# EAGLE design sofi_v7_main_rev2_1 (EAGLE 9.5.1)
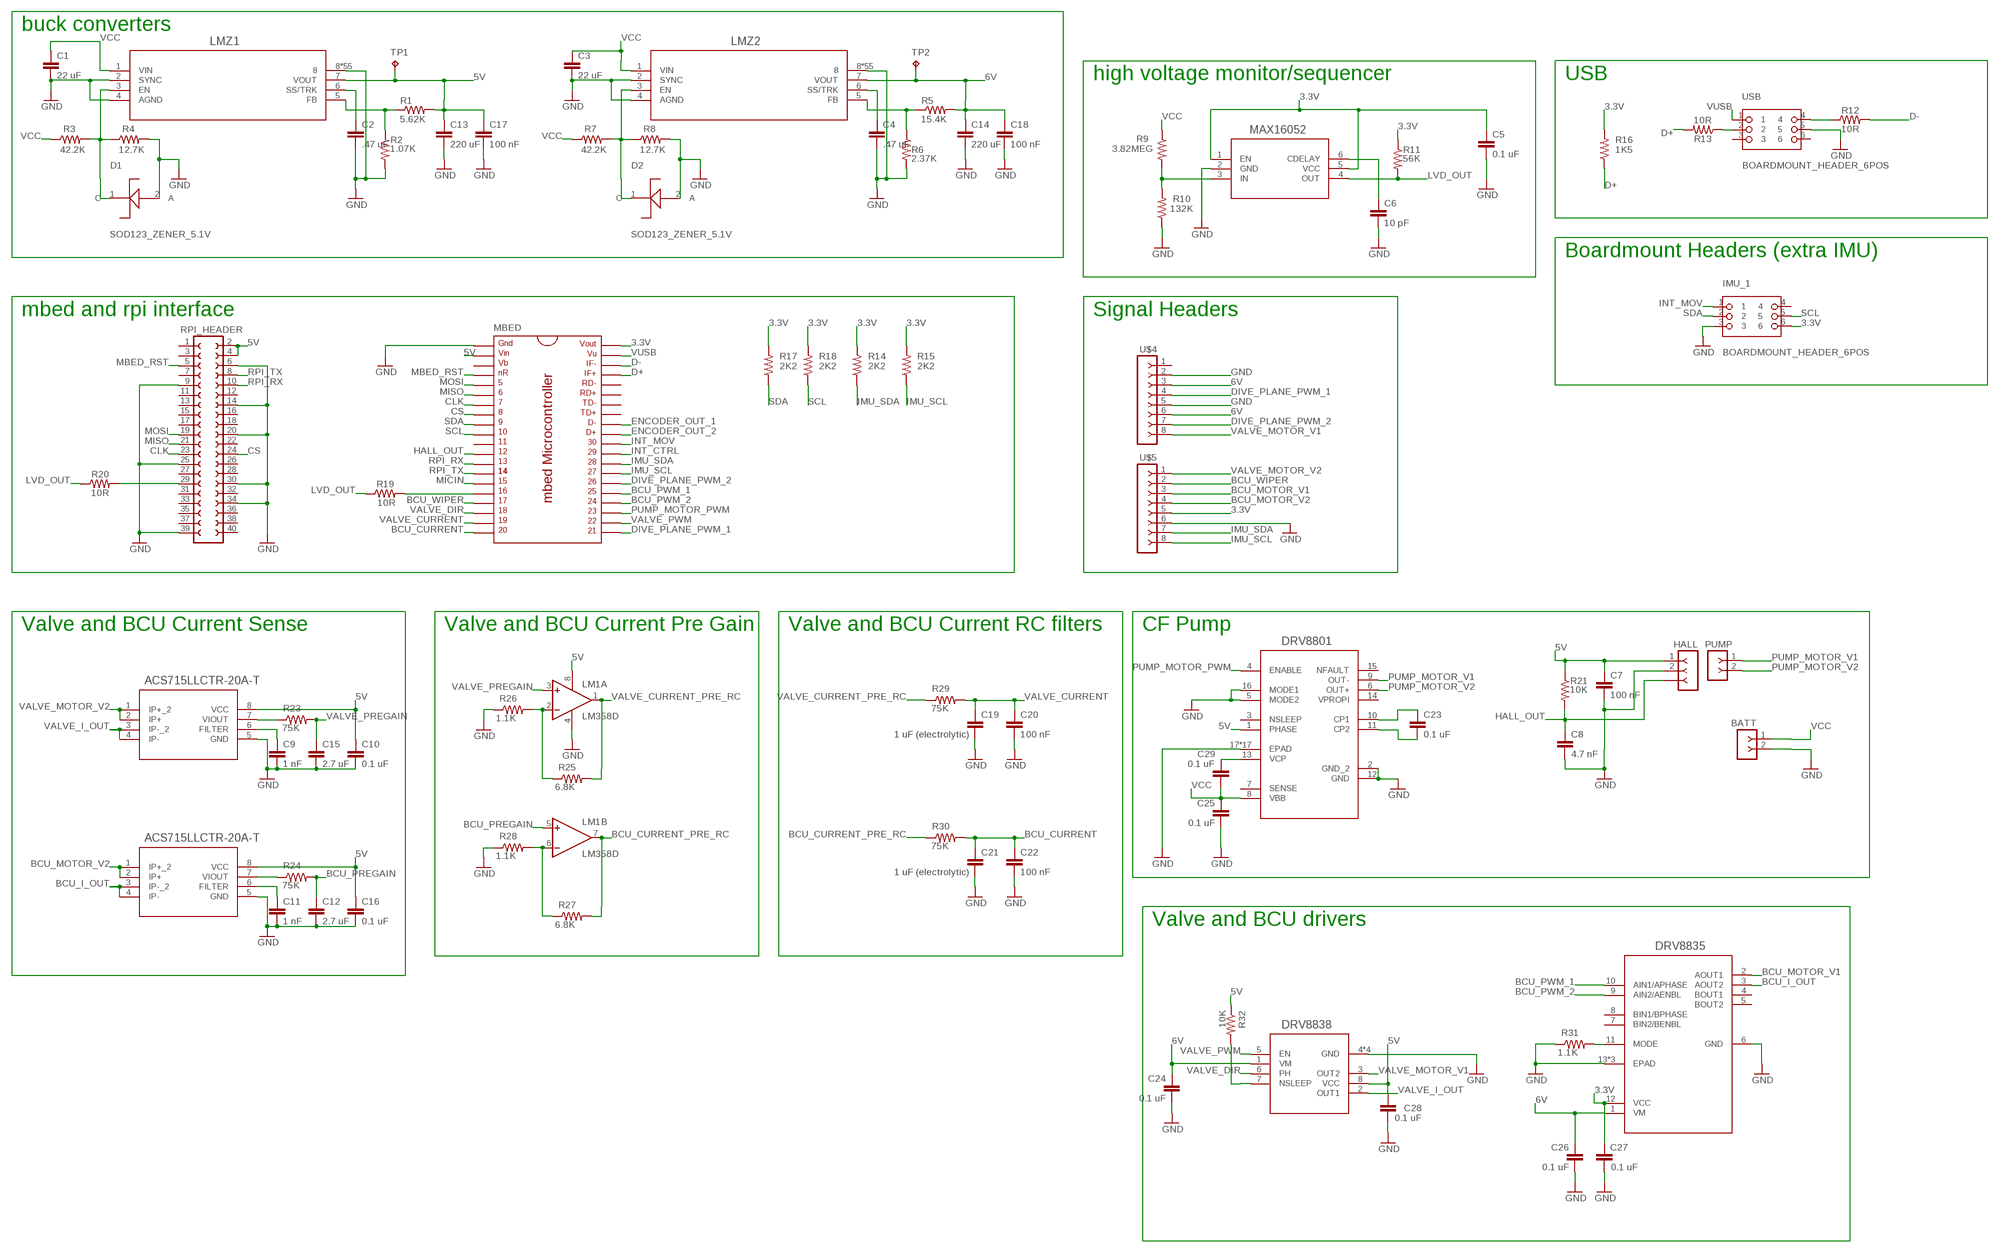
[diagram p0: schematic, sheet 1]

## Parts
BATT  2POS_BLOCK  [2POS_BLOCK]
C1  22 uF  C-EUC0805  [C0805]
C2  .47 uF  C-EUC0805  [C0805]
C3  22 uF  C-EUC0805  [C0805]
C4  .47 uF  C-EUC0805  [C0805]
C5  0.1 uF  C-EUC0805  [C0805]
C6  10 pF  C-EUC0603  [C0603]
C7  100 nF  C-EUC0805  [C0805]
C8  4.7 nF  C-EUC0805  [C0805]
C9  1 nF  C-EUC0603  [C0603]
C10  0.1 uF  C-EUC0603  [C0603]
C11  1 nF  C-EUC0603  [C0603]
C12  2.7 uF  C-EUC0603  [C0603]
C13  220 uF  C-EUC1206  [C1206]
C14  220 uF  C-EUC1206  [C1206]
C15  2.7 uF  C-EUC0603  [C0603]
C16  0.1 uF  C-EUC0603  [C0603]
C17  100 nF  C-EUC0805  [C0805]
C18  100 nF  C-EUC0805  [C0805]
C19  1 uF (electrolytic)  C-EUC0603  [C0603]
C20  100 nF  C-EUC0805  [C0805]
C21  1 uF (electrolytic)  C-EUC0603  [C0603]
C22  100 nF  C-EUC0805  [C0805]
C23  0.1 uF  C-EUC0805  [C0805]
C24  0.1 uF  C-EUC0603  [C0603]
C25  0.1 uF  C-EUC0603  [C0603]
C26  0.1 uF  C-EUC0603  [C0603]
C27  0.1 uF  C-EUC0603  [C0603]
C28  0.1 uF  C-EUC0603  [C0603]
C29  0.1 uF  C-EUC0805  [C0805]
D1  SOD123_ZENER_5.1V  [SOD123_ZENER]
D2  SOD123_ZENER_5.1V  [SOD123_ZENER]
DRV8801  DRV8801RTYTRTY16-THERMAL  [RTY16-THERMAL]
DRV8835  DRV8835DSSRDSS12_P9X2_THERMAL  [DSS12_P9X2_THERMAL]
DRV8838  DRV8838DSGTDSG8_P9X1P6_THERMAL  [DSG8_P9X1P6_THERMAL]
HALL  3POS_TERMINAL  [3POS_TERMINAL]
IMU_1  BOARDMOUNT_HEADER_6POS  [BOARDMOUNT_HEADER]
LM1  LM358D  [SO08]
LMZ1  LMZ23605TZE/NOPBTZA07A_THERMAL_TABBED  [TZA07A_THERMAL_TABBED]
LMZ2  LMZ23605TZE/NOPBTZA07A_THERMAL_TABBED  [TZA07A_THERMAL_TABBED]
MAX16052  MAX16052AUT+T  [21-0058I]
MBED  MBED_MICROCONTROLLER  [DIL40_0.9]
PUMP  2POS_BLOCK  [2POS_BLOCK]
R1  5.62K  R-US_M0805  [M0805]
R2  1.07K  R-US_M0805  [M0805]
R3  42.2K  R-US_M0805  [M0805]
R4  12.7K  R-US_M0805  [M0805]
R5  15.4K  R-US_M0805  [M0805]
R6  2.37K  R-US_M0805  [M0805]
R7  42.2K  R-US_M0805  [M0805]
R8  12.7K  R-US_M0805  [M0805]
R9  3.82MEG  RESISTOR0603  [0603]
R10  132K  RESISTOR0603  [0603]
R11  56K  R-US_R0603  [R0603]
R12  10R  RESISTOR0603  [0603]
R13  10R  RESISTOR0603  [0603]
R14  2K2  RESISTOR0603  [0603]
R15  2K2  RESISTOR0603  [0603]
R16  1K5  RESISTOR0603  [0603]
R17  2K2  RESISTOR0603  [0603]
R18  2K2  RESISTOR0603  [0603]
R19  10R  RESISTOR0603  [0603]
R20  10R  RESISTOR0603  [0603]
R21  10K  R-US_M0805  [M0805]
R23  75K  R-US_M0805  [M0805]
R24  75K  R-US_M0805  [M0805]
R25  6.8K  R-US_M0805  [M0805]
R26  1.1K  R-US_M0805  [M0805]
R27  6.8K  R-US_M0805  [M0805]
R28  1.1K  R-US_M0805  [M0805]
R29  75K  R-US_M0805  [M0805]
R30  75K  R-US_M0805  [M0805]
R31  1.1K  R-US_M0805  [M0805]
R32  10K  R-US_M0805  [M0805]
RPI_HEADER  FE20-2  [FE20-2]
TP1  TPB1,27  [B1,27]
TP2  TPB1,27  [B1,27]
U3_BCU  ACS715LLCTR-20A-T  [SOIC-8]
U3_VALVE  ACS715LLCTR-20A-T  [SOIC-8]
U$4  8POS_TERMINAL  [8POS_TERMINAL]
U$5  8POS_TERMINAL  [8POS_TERMINAL]
USB  BOARDMOUNT_HEADER_6POS  [BOARDMOUNT_HEADER]

## Nets
3.3V: C5.1 C27.1 DRV8835.12(VCC) IMU_1.6 MAX16052.1(EN) MAX16052.5(VCC) MBED.40 R11.1 R14.2 R15.2 R16.2 R17.2 R18.2 U$5.5
5V: C7.1 C10.1 C13.1 C16.1 C17.1 C28.1 DRV8801.1(PHASE) DRV8838.8(VCC) HALL.1 LM1.8(P:V+) LMZ1.7(VOUT) MBED.2 R1.2 R21.1 R32.1 RPI_HEADER.2 RPI_HEADER.4 TP1.TP U3_BCU.8(VCC) U3_VALVE.8(VCC)
6V: C14.1 C18.1 C24.1 C26.1 DRV8835.1(VM) DRV8838.1(VM) LMZ2.7(VOUT) R5.2 TP2.TP U$4.3 U$4.6
BCU_CURRENT: C21.1 C22.1 MBED.20 R30.2
BCU_CURRENT_PRE_RC: LM1.7(B:OUT) R27.2 R30.1
BCU_I_OUT: DRV8835.3(AOUT2) U3_BCU.3(IP-_2) U3_BCU.4(IP-)
BCU_MOTOR_V1: DRV8835.2(AOUT1) U$5.3
BCU_MOTOR_V2: U3_BCU.1(IP+_2) U3_BCU.2(IP+) U$5.4
BCU_PREGAIN: C12.1 LM1.5(B:+IN) R24.2
BCU_PWM_1: DRV8835.10(AIN1/APHASE) MBED.25
BCU_PWM_2: DRV8835.9(AIN2/AENBL) MBED.24
BCU_WIPER: MBED.17 U$5.2
CLK: MBED.7 RPI_HEADER.23
CS: MBED.8 RPI_HEADER.24
D+: MBED.37 R13.2 R16.1
D-: MBED.38 R12.2
DIVE_PLANE_PWM_1: MBED.21 U$4.4
DIVE_PLANE_PWM_2: MBED.26 U$4.7
ENCODER_OUT_1: MBED.32
ENCODER_OUT_2: MBED.31
GND: BATT.2 C1.2 C2.2 C3.2 C4.2 C5.2 C6.2 C7.2 C8.2 C9.2 C10.2 C11.2 C12.2 C13.2 C14.2 C15.2 C16.2 C17.2 C18.2 C19.2 C20.2 C21.2 C22.2 C24.2 C25.2 C26.2 C27.2 C28.2 D1.2(A) D2.2(A) DRV8801.2(GND_2) DRV8801.5(MODE2) DRV8801.12(GND) DRV8801.16(MODE1) DRV8801.17(EPAD) DRV8801.P$1(EPAD) DRV8801.P$2(EPAD) DRV8801.P$3(EPAD) DRV8801.P$4(EPAD) DRV8801.P$5(EPAD) DRV8801.P$6(EPAD) DRV8801.P$7(EPAD) DRV8801.P$8(EPAD) DRV8801.P$9(EPAD) DRV8801.P$10(EPAD) DRV8801.P$11(EPAD) DRV8801.P$12(EPAD) DRV8801.P$13(EPAD) DRV8801.P$14(EPAD) DRV8801.P$15(EPAD) DRV8801.P$16(EPAD) DRV8835.6(GND) DRV8835.13(EPAD) DRV8835.P$1(EPAD) DRV8835.P$2(EPAD) DRV8838.4(GND) DRV8838.9(GND) DRV8838.P$1(GND) DRV8838.P$2(GND) HALL.2 IMU_1.3 LM1.4(P:V-) LMZ1.2(SYNC) LMZ1.4(AGND) LMZ1.8 LMZ1.P$1 LMZ1.P$2 LMZ1.P$3 LMZ1.P$4 LMZ1.P$5 LMZ1.P$6 LMZ1.P$7 LMZ1.P$8 LMZ1.P$9 LMZ1.P$10 LMZ1.P$11 LMZ1.P$12 LMZ1.P$13 LMZ1.P$14 LMZ1.P$15 LMZ1.P$16 LMZ1.P$17 LMZ1.P$18 LMZ1.P$19 LMZ1.P$20 LMZ1.P$21 LMZ1.P$22 LMZ1.P$23 LMZ1.P$24 LMZ1.P$25 LMZ1.P$26 LMZ1.P$27 LMZ1.P$28 LMZ1.P$29 LMZ1.P$30 LMZ1.P$31 LMZ1.P$32 LMZ1.P$33 LMZ1.P$34 LMZ1.P$35 LMZ1.P$36 LMZ1.P$37 LMZ1.P$38 LMZ1.P$39 LMZ1.P$40 LMZ1.P$41 LMZ1.P$42 LMZ1.P$43 LMZ1.P$44 LMZ1.P$45 LMZ1.P$46 LMZ1.P$47 LMZ1.P$48 LMZ1.P$49 LMZ1.P$50 LMZ1.P$51 LMZ1.P$52 LMZ1.P$53 LMZ1.P$54 LMZ2.2(SYNC) LMZ2.4(AGND) LMZ2.8 LMZ2.P$1 LMZ2.P$2 LMZ2.P$3 LMZ2.P$4 LMZ2.P$5 LMZ2.P$6 LMZ2.P$7 LMZ2.P$8 LMZ2.P$9 LMZ2.P$10 LMZ2.P$11 LMZ2.P$12 LMZ2.P$13 LMZ2.P$14 LMZ2.P$15 LMZ2.P$16 LMZ2.P$17 LMZ2.P$18 LMZ2.P$19 LMZ2.P$20 LMZ2.P$21 LMZ2.P$22 LMZ2.P$23 LMZ2.P$24 LMZ2.P$25 LMZ2.P$26 LMZ2.P$27 LMZ2.P$28 LMZ2.P$29 LMZ2.P$30 LMZ2.P$31 LMZ2.P$32 LMZ2.P$33 LMZ2.P$34 LMZ2.P$35 LMZ2.P$36 LMZ2.P$37 LMZ2.P$38 LMZ2.P$39 LMZ2.P$40 LMZ2.P$41 LMZ2.P$42 LMZ2.P$43 LMZ2.P$44 LMZ2.P$45 LMZ2.P$46 LMZ2.P$47 LMZ2.P$48 LMZ2.P$49 LMZ2.P$50 LMZ2.P$51 LMZ2.P$52 LMZ2.P$53 LMZ2.P$54 MAX16052.2(GND) MBED.1 R2.2 R4.2 R6.2 R8.2 R10.1 R26.1 R28.1 R31.1 RPI_HEADER.6 RPI_HEADER.9 RPI_HEADER.14 RPI_HEADER.20 RPI_HEADER.25 RPI_HEADER.30 RPI_HEADER.34 RPI_HEADER.39 U3_BCU.5(GND) U3_VALVE.5(GND) U$4.2 U$4.5 U$5.6 USB.5
HALL_OUT: C8.1 HALL.3 MBED.12 R21.2
IMU_SCL: MBED.27 R15.1 U$5.8
IMU_SDA: MBED.28 R14.1 U$5.7
INT_CTRL: MBED.29
INT_MOV: IMU_1.1 MBED.30
LVD_OUT: MAX16052.4(OUT) R11.2 R19.1 R20.1
MBED_RST: MBED.4 RPI_HEADER.5
MICIN: MBED.15
MISO: MBED.6 RPI_HEADER.21
MOSI: MBED.5 RPI_HEADER.19
N$1: R20.2 RPI_HEADER.29
N$2: C23.1 DRV8801.10(CP1)
N$6: LMZ1.5(FB) R1.1 R2.1
N$7: MAX16052.3(IN) R9.2 R10.2
N$8: D1.1(C) LMZ1.3(EN) R3.2 R4.1
N$9: C4.1 LMZ2.6(SS/TRK)
N$10: LMZ2.5(FB) R5.1 R6.1
N$11: C2.1 LMZ1.6(SS/TRK)
N$12: C6.1 MAX16052.6(CDELAY)
N$13: D2.1(C) LMZ2.3(EN) R7.2 R8.1
N$16: R23.1 U3_VALVE.7(VIOUT)
N$18: C9.1 U3_VALVE.6(FILTER)
N$19: MBED.16 R19.2
N$20: R24.1 U3_BCU.7(VIOUT)
N$21: C11.1 U3_BCU.6(FILTER)
N$22: C23.2 DRV8801.11(CP2)
N$23: C29.1 DRV8801.13(VCP)
N$25: LM1.2(A:-IN) R25.1 R26.2
N$26: R12.1 USB.4
N$27: LM1.6(B:-IN) R27.1 R28.2
N$28: R13.1 USB.2
N$34: DRV8835.11(MODE) R31.2
N$42: DRV8838.7(NSLEEP) R32.2
PUMP_MOTOR_PWM: DRV8801.4(ENABLE) MBED.23
PUMP_MOTOR_V1: DRV8801.9(OUT-) PUMP.1
PUMP_MOTOR_V2: DRV8801.6(OUT+) PUMP.2
RPI_RX: MBED.13 RPI_HEADER.10
RPI_TX: MBED.14 RPI_HEADER.8
SCL: IMU_1.5 MBED.10 R18.1
SDA: IMU_1.2 MBED.9 R17.1
VALVE_CURRENT: C19.1 C20.1 MBED.19 R29.2
VALVE_CURRENT_PRE_RC: LM1.1(A:OUT) R25.2 R29.1
VALVE_DIR: DRV8838.6(PH) MBED.18
VALVE_I_OUT: DRV8838.2(OUT1) U3_VALVE.3(IP-_2) U3_VALVE.4(IP-)
VALVE_MOTOR_V1: DRV8838.3(OUT2) U$4.8
VALVE_MOTOR_V2: U3_VALVE.1(IP+_2) U3_VALVE.2(IP+) U$5.1
VALVE_PREGAIN: C15.1 LM1.3(A:+IN) R23.2
VALVE_PWM: DRV8838.5(EN) MBED.22
VCC: BATT.1 C1.1 C3.1 C25.1 C29.2 DRV8801.8(VBB) LMZ1.1(VIN) LMZ2.1(VIN) R3.1 R7.1 R9.1
VUSB: MBED.39 USB.1
Unconnected: DRV8801.3(NSLEEP) DRV8801.14(VPROPI) DRV8801.15(NFAULT) DRV8835.4(BOUT1) DRV8835.5(BOUT2) DRV8835.7(BIN2/BENBL) DRV8835.8(BIN1/BPHASE) IMU_1.4 MBED.3 MBED.11 MBED.33 MBED.34 MBED.35 MBED.36 RPI_HEADER.1 RPI_HEADER.3 RPI_HEADER.7 RPI_HEADER.11 RPI_HEADER.12 RPI_HEADER.13 RPI_HEADER.15 RPI_HEADER.16 RPI_HEADER.17 RPI_HEADER.18 RPI_HEADER.22 RPI_HEADER.26 RPI_HEADER.27 RPI_HEADER.28 RPI_HEADER.31 RPI_HEADER.32 RPI_HEADER.33 RPI_HEADER.35 RPI_HEADER.36 RPI_HEADER.37 RPI_HEADER.38 RPI_HEADER.40 U$4.1 USB.3 USB.6

## Notes on the sheet
- buck converters
- high voltage monitor/sequencer | USB
- Boardmount Headers (extra IMU)
- mbed and rpi interface | Signal Headers
- Valve and BCU Current Sense | Valve and BCU Current Pre Gain | Valve and BCU Current RC filters | CF Pump
- Valve and BCU drivers

## Power pins joined to a net without a drawn wire
SENSE: DRV8801.7(SENSE)

## Library data of the parts
BATT PUMP = 2pos_block_terminal:2POS_BLOCK
C1-C12 C15-C29 = rcl:C-EU: CAPACITOR, European symbol; SPICEPREFIX: C
C13 C14 = resistor:C-EU: CAPACITOR, European symbol
D1 D2 = SOD123_ZENER_DIODE:SOD123_ZENER_5.1V
DRV8801 = DRV8801_ultra_librarian:DRV8801RTYT
DRV8835 = DRV8835_ultra_librarian:DRV8835DSSR
DRV8838 = DRV8838:DRV8838DSGT
HALL = 3pos_block_terminal:3POS_TERMINAL
IMU_1 USB = 6pos connector:BOARDMOUNT_HEADER_6POS
LM1 = SO08_linear:LM358: OP AMP also LM158; LM258; LM2904 Source: http://cache.national.com/ds/LM/LM158.pdf
LMZ1 LMZ2 = fish_lmz2_ti:LMZ23605TZE/NOPB
MAX16052 = max:MAX16052AUT+T; MANUFACTURER_PART_NUMBER: max16052aut+t; VENDOR: Maxim Integrated Products
MBED = mbed-microcontroller:MBED_MICROCONTROLLER: mbed Microcontroller, DIP40, 0.9"
R1-R8 R11 R21 R23-R32 = rcl:R-US_: RESISTOR, American symbol; SPICEPREFIX: R
R9 R10 R12-R20 = SparkFun-Resistors:RESISTOR: Generic Resistor Package
RPI_HEADER = con-lsta:FE20-2: FEMALE HEADER; OC_FARNELL: unknown; OC_NEWARK: unknown
TP1 TP2 = testpad:TP: Test pad
U3_BCU U3_VALVE = acs715:ACS715LLCTR-20A-T; MANUFACTURER_PART_NUMBER: ACS715LLCTR20AT; VENDOR: Allegro Microsystems Inc.
U$4 U$5 = 8pos_block_terminal:8POS_TERMINAL

## Board
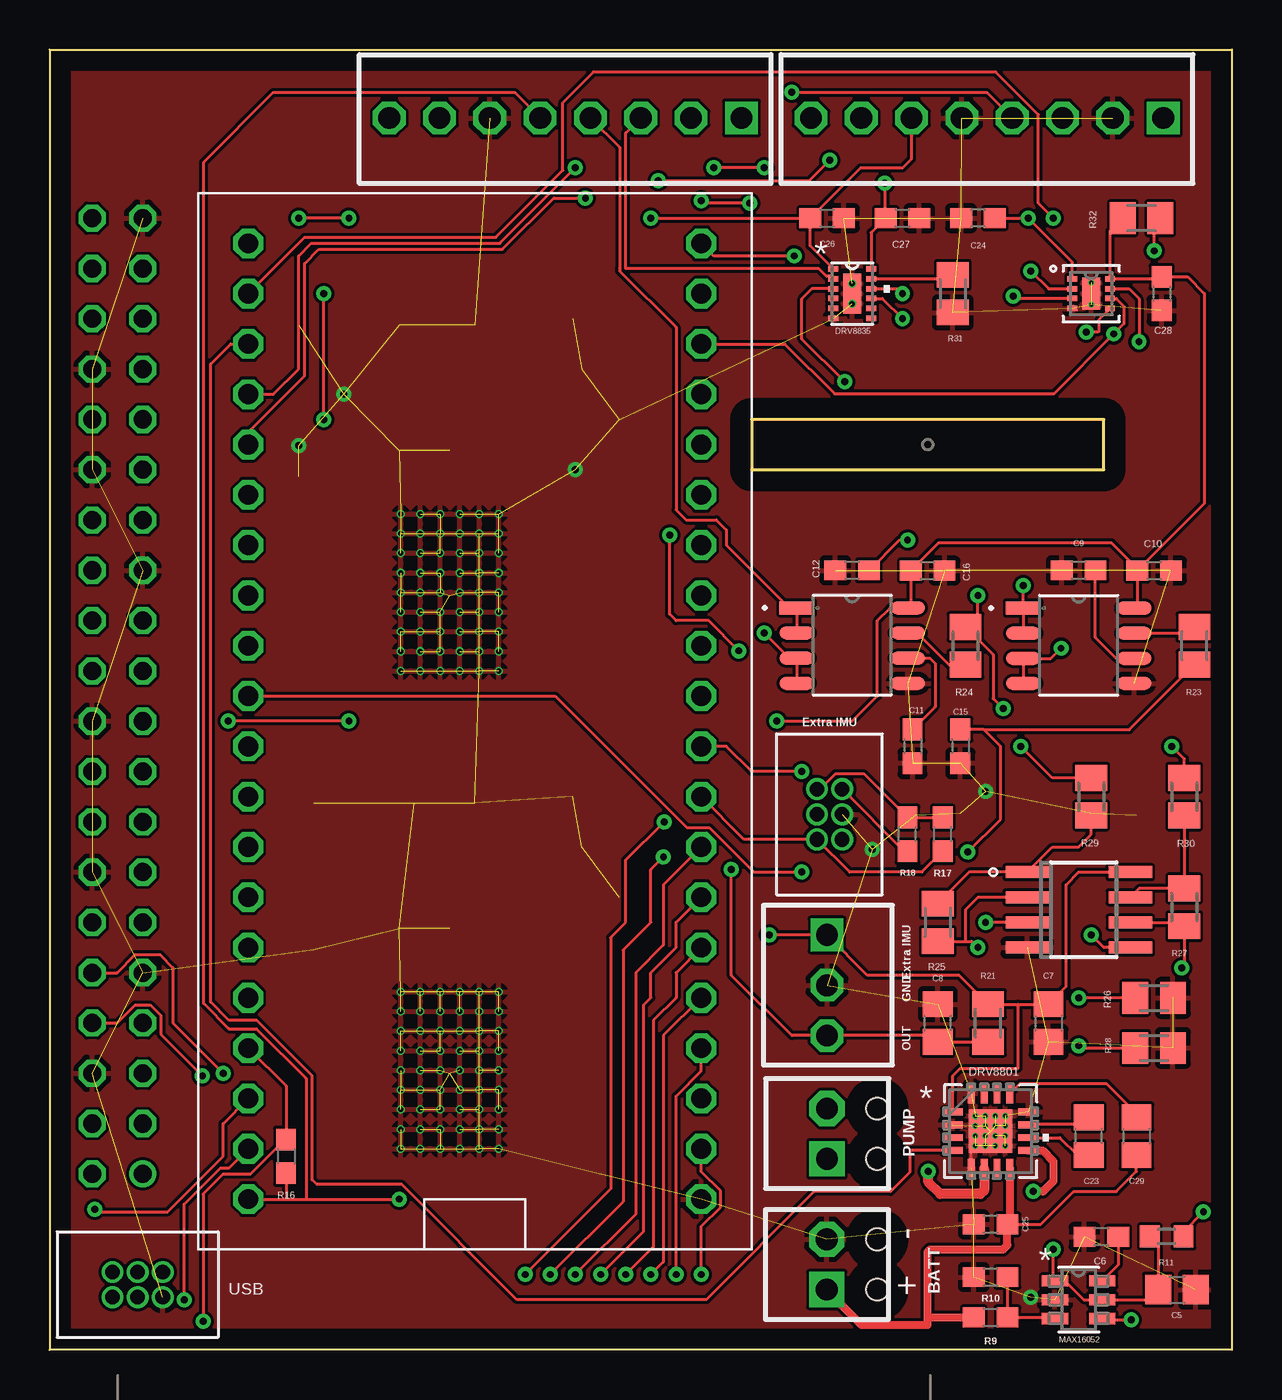
[diagram p1: board, top side]
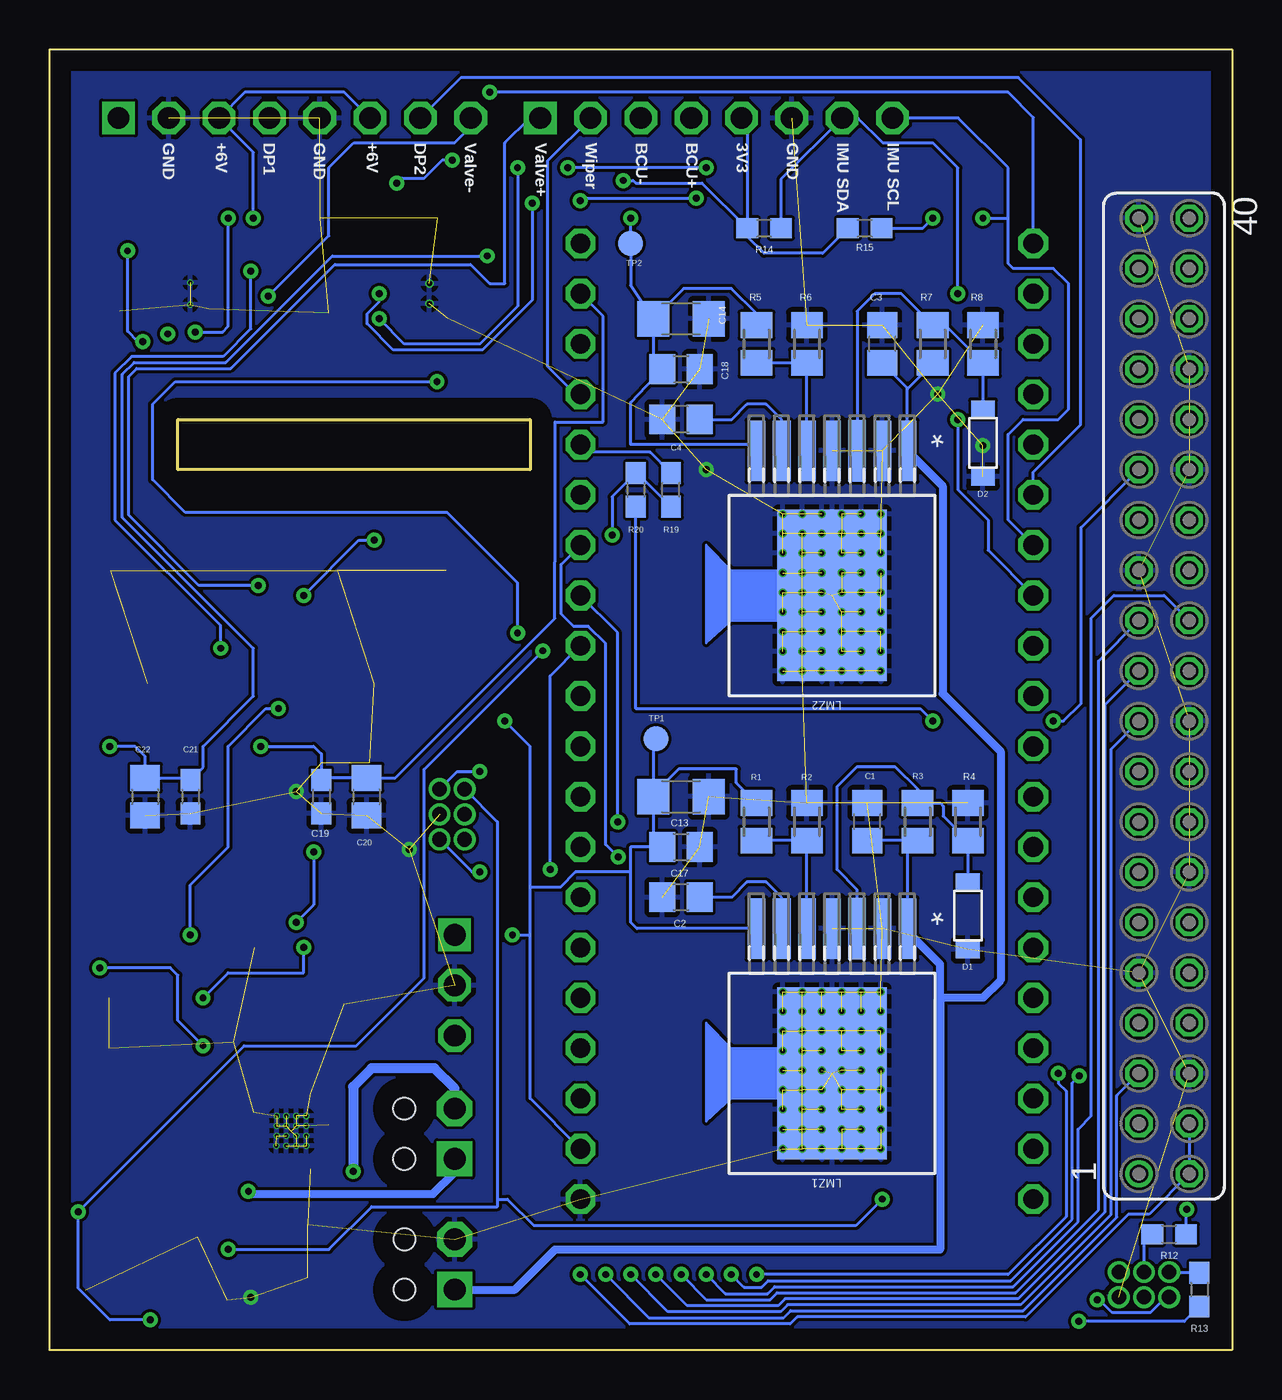
[diagram p2: board, bottom side, seen from below]

Size 59.69 x 65.67 mm. Coordinates in mm from the lower left corner, seen from the top.
Outline: 0,65.67 59.69,65.67 59.69,0 0,0 0,65.67
Outline: 35.43,46.99 35.43,44.45 53.21,44.45 53.21,46.99 35.43,46.99
Copper layers (1*16): Top 0.035mm / dielectric 1.5mm / Bottom 0.035mm
Design rules "default *": minimum track width 6mil, minimum drill 0.35mm, track to track 6mil, track to pad 6mil, pad to pad 5mil, via to via 6mil, smd to smd 6mil, copper to edge 40mil, drill to drill 6mil, minimum pad ring 2mil, minimum via ring 8mil, stop-mask expansion 4mil, vias tented up to drill 0mil, thermal gap 10mil

### Footprints (pad centres in the part's own frame; a part is rotated, then mirrored left to right if it is on the bottom)
2POS_BLOCK = drill 1.1 pad 1.778 square: 1 -1.27,1.27 | drill 1.1 pad 1.778 octagon: 2 1.27,1.27 | hole 1.1: -1.27,-1.27; 1.27,-1.27
C0805 = smd 1.3 x 1.5: 1 -0.95,0; 2 0.95,0
C0603 = smd 1.1 x 1: 1 -0.85,0; 2 0.85,0
C1206 = smd 1.6 x 1.8: 1 -1.4,0; 2 1.4,0
SOD123_ZENER = smd 0.9 x 1.2: 1 0,0; 2 3.4,0
RTY16-THERMAL = smd 1 x 0.35: 1 -1.9,0.975; 2 -1.9,0.325; 3 -1.9,-0.325; 4 -1.9,-0.975; 9 1.9,-0.975; 10 1.9,-0.325; 11 1.9,0.325; 12 1.9,0.975 | smd 0.35 x 1: 5 -0.975,-1.9; 6 -0.325,-1.9; 7 0.325,-1.9; 8 0.975,-1.9; 13 0.975,1.9; 14 0.325,1.9; 15 -0.325,1.9; 16 -0.975,1.9 | smd 2.2 x 2.2: 17 0,0 | drill 0.203 pad 0.254: P$1 -0.762,0.762; P$2 -0.27,0.762; P$3 0.238,0.762; P$4 0.73,0.762; P$5 -0.762,0.27; P$6 -0.27,0.27; P$7 0.238,0.27; P$8 0.73,0.27; P$9 -0.762,-0.238; P$10 -0.27,-0.238; P$11 0.238,-0.238; P$12 0.73,-0.238; P$13 -0.778,-0.746; P$14 -0.27,-0.746; P$15 0.238,-0.746; P$16 0.746,-0.746
DSS12_P9X2_THERMAL = smd 0.5 x 0.28: 1 -0.959,1.25; 2 -0.959,0.75; 3 -0.959,0.25; 4 -0.959,-0.25; 5 -0.959,-0.75; 6 -0.959,-1.25; 7 0.959,-1.25; 8 0.959,-0.75; 9 0.959,-0.25; 10 0.959,0.25; 11 0.959,0.75; 12 0.959,1.25 | smd 0.9 x 2: 13 0,0 | drill 0.279 pad 0.406: P$1 0,0.508; P$2 0,-0.508
DSG8_P9X1P6_THERMAL = smd 0.5 x 0.28: 1 -0.95,0.75; 2 -0.95,0.25; 3 -0.95,-0.25; 4 -0.95,-0.75; 5 0.95,-0.75; 6 0.95,-0.25; 7 0.95,0.25; 8 0.95,0.75 | smd 0.889 x 1.6: 9 0,0 | drill 0.2 pad 0.305: P$1 0,0.55; P$2 0,-0.55
3POS_TERMINAL = drill 1.1 pad 1.3 square: 1 -1.27,0 | drill 1.1 pad 1.3 octagon: 2 1.27,0; 3 3.81,0
BOARDMOUNT_HEADER = drill 0.737: 1 -1.27,-1.27; 2 -1.27,0; 3 0,-1.27; 4 0,0; 5 1.27,-1.27; 6 1.27,0
SO08 = smd 0.6 x 2.2: 1 -1.905,-2.6; 2 -0.635,-2.6; 3 0.635,-2.6; 4 1.905,-2.6; 5 1.905,2.6; 6 0.635,2.6; 7 -0.635,2.6; 8 -1.905,2.6
TZA07A_THERMAL_TABBED = smd 0.89 x 3.06: 1 -3.81,-7.305; 2 -2.54,-7.305; 4 0,-7.305; 5 1.27,-7.305; 6 2.54,-7.305; 7 3.81,-7.305 | smd 0.89 x 3.09: 3 -1.27,-7.305 | smd 5.512 x 8.661: 8 0,0 | drill 0.254 pad 0.406: P$1 -2.464,3.81; P$2 -1.473,3.81; P$3 -0.483,3.81; P$4 0.508,3.81; P$5 1.499,3.81; P$6 2.489,3.81; P$7 -2.464,2.819; P$8 -1.473,2.819; P$9 -0.483,2.819; P$10 0.508,2.819; P$11 1.499,2.819; P$12 2.489,2.819; P$13 -2.464,1.829; P$14 -1.473,1.829; P$15 -0.483,1.829; P$16 0.508,1.829; P$17 1.499,1.829; P$18 2.489,1.829; P$19 -2.464,0.838; P$20 -1.473,0.838; P$21 -0.483,0.838; P$22 0.508,0.838; P$23 1.499,0.838; P$24 2.489,0.838; P$25 -2.464,-0.152; P$26 -1.473,-0.152; P$27 -0.483,-0.152; P$28 0.508,-0.152; P$29 1.499,-0.152; P$30 2.489,-0.152; P$31 -2.464,-1.143; P$32 -1.473,-1.143; P$33 -0.483,-1.143; P$34 0.508,-1.143; P$35 1.499,-1.143; P$36 2.489,-1.143; P$37 -2.464,-2.134; P$38 -1.473,-2.134; P$39 -0.483,-2.134; P$40 0.508,-2.134; P$41 1.499,-2.134; P$42 2.489,-2.134; P$43 -2.464,-3.124; P$44 -1.473,-3.124; P$45 -0.483,-3.124; P$46 0.508,-3.124; P$47 1.499,-3.124; P$48 2.489,-3.124; P$49 -2.464,-4.115; P$50 -1.473,-4.115; P$51 -0.483,-4.115; P$52 0.508,-4.115; P$53 1.499,-4.115; P$54 2.489,-4.115
21-0058I = smd 1.321 x 0.559: 1 -1.194,0.95; 2 -1.194,0; 3 -1.194,-0.95; 4 1.194,-0.95; 5 1.194,0; 6 1.194,0.95
DIL40_0.9 = drill 1 pad 1.397 octagon: 1 -22.86,-11.43; 2 -20.32,-11.43; 3 -17.78,-11.43; 4 -15.24,-11.43; 5 -12.7,-11.43; 6 -10.16,-11.43; 7 -7.62,-11.43; 8 -5.08,-11.43; 9 -2.54,-11.43; 10 0,-11.43; 11 2.54,-11.43; 12 5.08,-11.43; 13 7.62,-11.43; 14 10.16,-11.43; 15 12.7,-11.43; 16 15.24,-11.43; 17 17.78,-11.43; 18 20.32,-11.43; 19 22.86,-11.43; 20 25.4,-11.43; 21 25.4,11.43; 22 22.86,11.43; 23 20.32,11.43; 24 17.78,11.43; 25 15.24,11.43; 26 12.7,11.43; 27 10.16,11.43; 28 7.62,11.43; 29 5.08,11.43; 30 2.54,11.43; 31 0,11.43; 32 -2.54,11.43; 33 -5.08,11.43; 34 -7.62,11.43; 35 -10.16,11.43; 36 -12.7,11.43; 37 -15.24,11.43; 38 -17.78,11.43; 39 -20.32,11.43; 40 -22.86,11.43
M0805 = smd 1.3 x 1.6: 1 -0.95,0; 2 0.95,0
0603 = smd 1.1 x 1: 1 -0.85,0; 2 0.85,0
R0603 = smd 1 x 1.1: 1 -0.85,0; 2 0.85,0
FE20-2 = drill 0.914: 1 -24.13,1.27 | drill 0.914 octagon: 2 -24.13,-1.27; 3 -21.59,1.27; 4 -21.59,-1.27; 5 -19.05,1.27; 6 -19.05,-1.27; 7 -16.51,1.27; 8 -16.51,-1.27; 9 -13.97,1.27; 10 -13.97,-1.27; 11 -11.43,1.27; 12 -11.43,-1.27; 13 -8.89,1.27; 14 -8.89,-1.27; 15 -6.35,1.27; 16 -6.35,-1.27; 17 -3.81,1.27; 18 -3.81,-1.27; 19 -1.27,1.27; 20 -1.27,-1.27; 21 1.27,1.27; 22 1.27,-1.27; 23 3.81,1.27; 24 3.81,-1.27; 25 6.35,1.27; 26 6.35,-1.27; 27 8.89,1.27; 28 8.89,-1.27; 29 11.43,1.27; 30 11.43,-1.27; 31 13.97,1.27; 32 13.97,-1.27; 33 16.51,1.27; 34 16.51,-1.27; 35 19.05,1.27; 36 19.05,-1.27; 37 21.59,1.27; 38 21.59,-1.27; 39 24.13,1.27; 40 24.13,-1.27
B1,27 = smd 1.27 x 1.27: TP 0,0
SOIC-8 = smd 1.753 x 0.66: 1 -2.8,1.905; 2 -2.8,0.635; 3 -2.8,-0.635; 4 -2.8,-1.905; 5 2.8,-1.905; 6 2.8,-0.635; 7 2.8,0.635; 8 2.8,1.905
8POS_TERMINAL = drill 1.1 pad 1.3 square: 1 -8.89,0 | drill 1.1 pad 1.3 octagon: 2 -6.35,0; 3 -3.81,0; 4 -1.27,0; 5 1.27,0; 6 3.81,0; 7 6.35,0; 8 8.89,0

### Placement (x,y rotation side)
BATT  40.5,4.32 90 top
C1  18.42,26.67 90 bottom
C2  27.82,22.86 180 bottom
C3  17.66,50.8 90 bottom
C4  27.82,46.99 180 bottom
C5  56.91,3.05 0 top
C6  53.09,5.72 180 top
C7  50.42,16.51 270 top
C8  44.83,16.51 90 top
C9  51.95,39.37 180 top
C10  55.75,39.36 0 top
C11  43.56,30.48 270 top
C12  40.52,39.37 180 top
C13  27.82,27.94 0 bottom
C14  27.82,52.07 0 bottom
C15  45.98,30.48 270 top
C16  44.32,39.36 0 top
C17  27.82,25.4 0 bottom
C18  27.82,49.53 0 bottom
C19  45.98,27.94 270 bottom
C20  43.69,27.94 270 bottom
C21  52.58,27.94 270 bottom
C22  54.87,27.94 270 bottom
C23  52.45,10.8 90 top
C24  46.86,57.15 180 top
C25  47.5,6.35 180 top
C26  39.24,57.15 0 top
C27  43.05,57.15 0 top
C28  56.14,53.34 270 top
C29  54.87,10.8 270 top
D1  13.34,23.62 270 bottom
D2  12.58,47.5 270 bottom
DRV8801  47.5,11.05 0 top
DRV8835  40.52,53.34 0 top
DRV8838  52.58,53.34 0 top
HALL  39.24,19.69 270 top
IMU_1  38.74,27.05 90 top
LM1  51.95,22.23 270 top
LMZ1  20.2,13.97 180 bottom
LMZ2  20.2,38.1 180 bottom
MAX16052  51.95,2.54 0 top
MBED  21.46,30.48 90 top
PUMP  40.52,10.92 90 top
R1  24.01,26.67 90 bottom
R2  21.46,26.67 90 bottom
R3  15.88,26.67 90 bottom
R4  13.34,26.67 90 bottom
R5  24.01,50.8 90 bottom
R6  21.46,50.8 90 bottom
R7  15.12,50.8 90 bottom
R8  12.58,50.8 90 bottom
R9  47.5,1.65 0 top
R10  47.5,3.68 0 top
R11  56.39,5.74 0 top
R12  3.18,5.84 0 bottom
R13  1.65,3.05 270 bottom
R14  23.62,56.64 180 bottom
R15  18.54,56.64 180 bottom
R16  11.94,9.78 270 top
R17  45.09,26.04 90 top
R18  43.31,26.04 90 top
R19  28.32,43.43 90 bottom
R20  30.1,43.43 270 bottom
R21  47.37,16.51 270 top
R23  57.79,35.56 270 top
R24  46.23,35.56 90 top
R25  44.83,21.59 90 top
R26  55.75,17.78 180 top
R27  57.28,22.35 90 top
R28  55.75,15.25 180 top
R29  52.58,27.94 90 top
R30  57.28,27.94 90 top
R31  45.59,53.34 90 top
R32  55.12,57.15 0 top
RPI_HEADER  3.43,33.02 90 bottom
TP1  29.09,30.86 0 bottom
TP2  30.36,55.88 0 bottom
U3_BCU  40.52,35.57 0 top
U3_VALVE  51.95,35.56 0 top
U$4  47.32,62.21 180 top
U$5  26.03,62.21 180 top
USB  4.45,3.94 0 top

### Tracks (layer width: path | path; a pad name or v marks a point on that pad's centre or on a via)
3.3V  (via drill 0.35)
  Top 0.152: R11.1 55.96,5.32 C5.1 55.45,2.54 MAX16052.5 52.2,2.54 51.25,3.49 MAX16052.1 50.67,3.57 v50.67,5.08 | DRV8835.12 41.47,56.42 C27.1 42.17,57.19 v42.17,58.93 | U$5.5 23.47,63.5 11.3,63.5 7.78,59.97 7.78,17.5 9.06,16.22 10.44,16.22 12.96,13.7 12.96,7.62 | MBED.40 11.94,7.62 | 11.94,7.62 12.96,7.62 | 12.96,7.62 v17.66,7.62 | R17.2 R18.2 41.09,29.1 39.68,29.1 38.9,28.32 IMU_1.6 | v30.74,59.05 38.36,59.05 v39.37,60.07 | R16.2 11.94,7.62
  Bottom 0.152: U$5.5 24.47,61.92 R14.2 | R15.2 20.66,55.37 23.62,55.37 24.47,56.22 R14.2 | v17.66,7.62 19,6.27 35.23,6.27 36.58,7.62 37.09,7.62 | v50.67,5.08 45.59,5.08 43.44,7.24 37.09,7.24 37.09,7.62 | IMU_1.6 37.09,26.67 37.09,7.62 | R14.2 26.76,58.93 30.1,58.93 30.23,59.05 v30.74,59.05 | v42.17,58.93 41.91,59.18 40.77,59.18 39.88,60.07 v39.37,60.07
5V  (via drill 0.35)
  Top 0.152: v32.89,3.81 32.89,6.24 33.87,7.22 33.87,8.02 32.89,9 MBED.2 | 48.9,17.46 R21.1 45.91,18.92 41.28,18.92 HALL.1 v36.32,20.96 | 48.9,17.46 C7.1 51.31,18.35 51.31,23.5 51.95,24.13 LM1.8 | DRV8801.1 45.6,13.85 45.98,14.22 48.9,14.22 48.9,17.46 | C10.1 54.91,37.62 U3_VALVE.8 | R32.1 53.53,56.51 DRV8838.8 56.04,54.09 C28.1 57.45,54.19 58.29,53.34 58.29,42.75 C10.1 | v36.7,31.75 40.52,31.75 41.78,33.02 41.78,36.83 42.43,37.48 U3_BCU.8 43.47,37.63 C16.1 44.88,40.77 53.6,40.77 54.91,39.46 C10.1
  Bottom 0.152: C13.1 29.21,28.06 27.94,29.34 25.02,29.34 25.02,28.64 R1.2 | C17.1 28.83,25.4 | 28.83,25.4 30.36,25.4 30.36,24.13 | C13.1 29.21,25.78 28.83,25.4 | LMZ1.7 30.04,21.28 30.36,21.59 30.36,24.13 | MBED.2 35.43,12.7 35.43,20.96 | 35.43,20.96 35.43,23.37 | 35.43,23.37 35.43,30.48 v36.7,31.75 | TP1.TP 29.21,30.73 C13.1 | v32.89,3.81 30.41,1.32 22.3,1.32 21.95,1.68 10.42,1.68 5.24,6.86 4.19,6.86 RPI_HEADER.2 RPI_HEADER.4 | 30.36,24.13 33.15,24.13 33.91,23.37 35.43,23.37 | v36.32,20.96 35.43,20.96
6V  (via drill 0.35)
  Top 0.152: DRV8835.1 38.39,55.75 C26.1 | v30.36,57.15 C26.1 | C24.1 v49.41,57.15 51.63,54.93 DRV8838.1 | C26.1 40.93,59.69 43.05,59.69 43.51,60.15 U$4.6
  Bottom 0.152: LMZ2.7 24.48,45.72 30.36,45.72 30.36,47.84 C18.1 29.21,49.98 C14.1 | C14.1 30.36,53.76 TP2.TP v30.36,57.15 | C14.1 27.69,53.59 25.28,53.59 24.01,52.32 R5.2 | v49.41,57.15 49.41,60.48 U$4.3 49.84,63.5 44.8,63.5 U$4.6
BCU_CURRENT  (via drill 0.35)
  Top 0.152: R30.2 57.28,29.84 v56.64,30.48 | v37.59,55.24 33.53,55.24 MBED.20
  Bottom 0.152: v56.64,30.48 55.37,30.48 54.87,29.97 C22.1 52.68,28.89 C21.1 51.95,29.43 51.95,30.48 49.41,33.02 49.41,35.43 56.01,42.04 56.01,49.28 55.42,49.86 50.8,49.86 45.42,55.24 v37.59,55.24
BCU_CURRENT_PRE_RC
  Top 0.152: LM1.7 55,23.3 R27.2 R30.1
BCU_I_OUT  (via drill 0.35)
  Top 0.152: U3_BCU.4 U3_BCU.3 37.33,34.94 v36.07,36.2 | DRV8835.3 38.48,53.59 37.97,53.09 37.97,51.05 v40.13,48.9
  Bottom 0.152: v36.07,36.2 36.07,38.73 39.63,42.29 52.83,42.29 54.48,43.94 54.48,47.75 53.34,48.9 v40.13,48.9
BCU_MOTOR_V1
  Top 0.152: DRV8835.2 39.42,54.22 39.21,54.22 38.82,54.61 29.09,54.61 29.09,61.45 U$5.3
BCU_MOTOR_V2
  Top 0.152: U3_BCU.2 U3_BCU.1 37.33,37.48 34.16,40.64 34.16,41.4 33.66,41.91 32.13,41.91 31.63,42.42 31.63,51.64 28.78,54.48 28.78,54.61 28.78,60.73 U$5.4
BCU_PREGAIN  (via drill 0.35)
  Top 0.152: v46.86,38.1 46.86,37.15 R24.2 47.63,35.11 47.63,32.89 v48.13,32.38 | v43.31,40.89 42.89,40.89 C12.1 | LM1.5 53.21,20.32 v52.58,20.96
  Bottom 0.152: v46.86,38.1 44.07,40.89 v43.31,40.89 | v52.58,20.96 52.58,23.5 50.67,25.4 50.67,30.48 48.77,32.38 v48.13,32.38
BCU_PWM_1  (via drill 0.35)
  Top 0.152: DRV8835.10 42.8,53.59 v43.05,53.34 | MBED.25 9.91,45.85 9.91,46.23 12.88,49.2 12.88,54.87 13.59,55.58 22.86,55.58 25.45,58.17 v27.05,58.17 | v32.89,58.04 33.02,57.91 v35.34,57.91
  Bottom 0.152: v27.05,58.17 32.77,58.17 v32.89,58.04 | v35.34,57.91 35.34,53.01 37.85,50.49 42.34,50.49 43.66,51.82 43.66,52.32 43.05,52.93 v43.05,53.34
BCU_PWM_2  (via drill 0.35)
  Top 0.152: DRV8835.9 42.03,53.09 v43.05,52.07 | MBED.24 11.3,48.26 12.58,49.53 12.58,55.24 13.21,55.88 22.74,55.88 v26.55,59.69 | v36.07,59.69 v33.53,59.69
  Bottom 0.152: v43.05,52.07 41.78,50.8 37.97,50.8 36.07,52.7 v36.07,59.69 | v26.55,59.69 v33.53,59.69
BCU_WIPER
  Bottom 0.152: U$5.2 34.55,60.05 34.55,49.66 33.15,48.26 MBED.17
CLK  (via drill 0.35)
  Top 0.152: v27.82,3.81 29.97,5.97 29.97,17.4 30.36,17.78 30.36,19.05 31.63,20.32 31.63,21.59 MBED.7
  Bottom 0.152: RPI_HEADER.23 6.73,34.8 6.73,7.09 10.93,2.9 22.96,2.9 23.32,2.54 26.55,2.54 v27.82,3.81
CS  (via drill 0.35)
  Top 0.152: MBED.8 30.99,23.5 30.99,20.45 29.59,19.05 29.59,6.86 v26.55,3.81
  Bottom 0.152: RPI_HEADER.24 3.43,38.1 5.97,38.1 7.11,36.96 7.11,11.81 7.77,11.15 7.77,6.48 11.05,3.2 23.09,3.2 23.45,2.84 25.58,2.84 v26.55,3.81
D+  (via drill 0.35)
  Top 0.152: v7.75,1.44 7.75,7.87 8.76,8.89 10.15,8.89 11.89,10.63 R16.1 11.94,13.34 MBED.37
  Bottom 0.152: R13.2 2.41,1.44 v7.75,1.44
D-  (via drill 0.35)
  Top 0.152: MBED.38 8.76,11.43 8.76,9.78 5.97,6.99 2.41,6.99 v2.29,7.11
  Bottom 0.152: v2.29,7.11 2.33,7.07 R12.2
DIVE_PLANE_PWM_1  (via drill 0.35)
  Top 0.152: v37.47,63.5 47.3,63.5 U$4.4
  Bottom 0.152: MBED.21 10.04,62.23 11.3,63.5 v37.47,63.5
DIVE_PLANE_PWM_2
  Bottom 0.152: MBED.26 10.04,44.33 7.65,46.71 7.65,61.12 10.79,64.25 38.93,64.25 U$4.7
GND  (via drill 0.35)  (201 unrouted)
  Top 0.152: DRV8801.5 46.52,10.11 DRV8801.P$13 | DRV8801.17 DRV8801.P$11
  other vias: 26.55,44.45 14.86,48.26 12.58,45.67 49.53,2.67 41.53,25.27 47.25,28.19
  pour Top: -0.38,65.28 -0.38,-0.25 59.56,-0.25 59.56,65.28
  pour Bottom: -0.25,65.91 59.56,65.91 59.56,-0.13 -0.25,-0.13
HALL_OUT  (via drill 0.35)
  Top 0.152: R21.2 C8.1 44.52,15.88 HALL.3 37.47,15.88 34.42,18.92 v34.42,24.26
  Bottom 0.152: v34.42,24.26 34.42,34.04 MBED.12
IMU_SCL  (via drill 0.35)
  Top 0.152: v15.12,57.15 v12.58,57.15
  Bottom 0.152: MBED.27 11.3,41.91 11.3,46.23 10.54,46.99 8.76,46.99 8.26,47.5 8.26,53.85 9.02,54.61 11.05,54.61 11.3,54.86 11.3,57.15 | 11.3,57.15 11.3,59.69 13.82,62.21 U$5.8 | R15.1 15.62,56.64 v15.12,57.15 | v12.58,57.15 11.3,57.15
IMU_SDA  (via drill 0.35)
  Top 0.152: v13.85,46.99 v13.85,53.34
  Bottom 0.152: v13.85,46.99 13.85,43.43 12.32,41.91 12.32,40.39 MBED.28 | v13.85,53.34 13.85,59.69 15.09,60.94 17.62,60.94 18.88,62.21 U$5.7 22.77,59.12 R14.1
INT_MOV  (via drill 0.35)
  Top 0.152: MBED.30 25.53,33.02 32.17,26.38 33.3,26.38 35.55,24.13 v37.97,24.13
  Bottom 0.152: IMU_1.1 38.36,24.13 v37.97,24.13
LVD_OUT  (via drill 0.35)
  Top 0.152: v58.25,6.99 57.24,5.98 R11.2 | v31.3,41.15 31.3,37.16 31.63,36.83 33.28,36.83 v34.8,35.31 | MAX16052.4 53.2,1.52 v54.61,1.52
  Bottom 0.152: v54.61,1.52 56.64,1.52 58.25,3.13 v58.25,6.99 49.86,15.37 44.2,15.37 40.79,18.78 40.79,29.32 v34.8,35.31 | R19.1 30.02,44.28 R20.1 31.3,43.09 v31.3,41.15
MBED_RST  (via drill 0.35)
  Top 0.152: MBED.4 32.89,14.08 31.63,12.81 v31.63,3.81
  Bottom 0.152: v31.63,3.81 29.44,1.63 22.63,1.63 22.28,1.98 10.55,1.98 5.82,6.71 5.82,12.85 RPI_HEADER.5
MISO  (via drill 0.35)
  Top 0.152: MBED.6 31.63,19.05 31.63,17.78 30.48,16.64 30.48,5.21 v29.09,3.81
  Bottom 0.152: v29.09,3.81 27.51,2.24 22.91,2.24 22.56,2.59 10.8,2.59 6.43,6.96 6.43,32.56 RPI_HEADER.21
MOSI  (via drill 0.35)
  Top 0.152: MBED.5 30.99,15.88 30.99,4.45 v30.36,3.81
  Bottom 0.152: v30.36,3.81 28.47,1.93 22.79,1.93 22.43,2.29 10.67,2.29 6.12,6.84 6.12,30.33 RPI_HEADER.19
N$1  (via drill 0.35)
  Top 0.152: v15.12,31.75 v9.02,31.75
  Bottom 0.152: v15.12,31.75 15.75,32.38 30.1,32.38 R20.2 | v9.02,31.75 8.51,31.75 7.62,32.64 7.62,41.53 RPI_HEADER.29
N$2
  Top 0.152: DRV8801.10 51,10.72 51.88,9.84 C23.1
N$6
  Bottom 0.152: LMZ1.5 R2.1 R1.1
N$7
  Top 0.152: R10.2 R9.2 50.69,1.65 MAX16052.3
N$8
  Bottom 0.152: D1.1 R4.1 14.58,26.96 14.58,27.48 14.72,27.62 R3.2 15.88,28.32 17.02,29.46 18.93,29.46 19.94,28.45 19.94,24.26 18.93,23.24 LMZ1.3
N$9
  Bottom 0.152: C4.1 25.26,46.99 24.49,47.75 23.52,47.75 22.74,46.97 LMZ2.6
N$10
  Bottom 0.152: R5.1 R6.1 LMZ2.5
N$11
  Bottom 0.152: C2.1 25.26,22.86 24.49,23.62 23.52,23.62 22.74,22.84 LMZ1.6
N$12
  Top 0.152: C6.1 53.94,4.29 MAX16052.6
N$13
  Bottom 0.152: D2.1 R8.1 14.47,51.75 R7.2 16.71,53.34 18.04,53.34 18.93,52.45 LMZ2.3
N$16
  Top 0.152: U3_VALVE.7 57.47,36.2 R23.1
N$18
  Top 0.152: U3_VALVE.6 53.85,34.93 52.79,35.98 C9.1
N$19
  Bottom 0.152: R19.2 29.38,45.34 32.51,45.34 MBED.16
N$20
  Top 0.152: U3_BCU.7 43.81,36.2 45.4,34.61 R24.1
N$21
  Top 0.152: U3_BCU.6 44.44,34.94 44.71,34.67 44.71,32.47 C11.1
N$22
  Top 0.152: DRV8801.11 49.46,11.43 52.14,11.43 C23.2
N$23
  Top 0.152: DRV8801.13 48.99,13.46 53.34,13.46 54.87,11.94 C29.1
N$25  (via drill 0.35)
  Top 0.152: R26.2 v51.95,17.78 | R25.1 46.23,20.64 | 46.23,20.64 46.54,20.64 v46.86,20.32 | 46.23,20.64 46.23,22.23 46.86,22.86 LM1.2
  Bottom 0.152: v51.95,17.78 50.67,19.05 46.86,19.05 v46.86,20.32
N$26
  Bottom 0.152: R12.1 4.45,5.42 USB.4
N$27  (via drill 0.35)
  Top 0.152: v51.95,15.37 52.06,15.25 R28.2 | LM1.6 57.09,21.59 R27.1 57.28,19.43 v57.15,19.3
  Bottom 0.152: v57.15,19.3 53.6,19.3 53.21,18.92 53.21,16.64 v51.95,15.37
N$28
  Bottom 0.152: R13.1 3.14,3.9 USB.2
N$34
  Top 0.152: DRV8835.11 45.39,54.09 R31.2
N$42  (via drill 0.35)
  Top 0.152: v55.75,55.5 55.75,56.84 R32.2 | DRV8838.7 54.49,53.59 54.99,53.09 v54.99,50.93
  Bottom 0.152: v54.99,50.93 55.25,50.93 55.75,51.44 v55.75,55.5
PUMP_MOTOR_PWM
  Top 0.152: DRV8801.4 43.43,10.07 43.43,8.97 42.46,8 38.61,8 33.15,2.54 23.59,2.54 17.78,8.35 13.49,8.35 13.26,8.59 13.26,13.84 10.45,16.65 9.06,16.65 8.13,17.58 8.13,49.78 9.15,50.8 MBED.23
PUMP_MOTOR_V1  (via drill 0.35)
  Top 0.406: DRV8801.9 50.13,10.07 50.67,9.52 50.67,8.53 50.16,8.01 v49.65,8.01
  Bottom 0.305: 49.52,7.88 v49.65,8.01
  Bottom 0.406: PUMP.1 39.24,8.98 40.34,7.88 49.52,7.88
PUMP_MOTOR_V2  (via drill 0.35)
  Top 0.508: DRV8801.6 47.17,8.06 46.99,7.87 44.96,7.87 44.36,8.47 v44.36,9.02
  Bottom 0.508: PUMP.2 39.24,13.21 40.26,14.22 43.44,14.22 44.36,13.3 v44.36,9.02
RPI_RX  (via drill 0.35)
  Top 0.152: RPI_HEADER.10 3.41,19.05 4.32,19.96 5.56,19.96 6.22,19.3 6.22,16.51 v8.76,13.97 | v24.01,3.81 28.32,8.13 28.32,20.83 29.09,21.59 29.09,24.74 v31.02,26.67
  Bottom 0.152: v31.02,26.67 31.02,36.22 MBED.13 | v8.76,13.97 8.76,13.46 8.38,13.08 8.38,6.73 11.3,3.81 v24.01,3.81
RPI_TX  (via drill 0.35)
  Top 0.152: RPI_HEADER.8 3.41,16.51 4.32,17.42 5.08,17.42 5.62,16.89 5.62,15.95 v7.72,13.84 | v25.28,3.81 28.96,7.49 28.96,20.19 30.36,21.59 30.36,24.26 v30.99,24.89
  Bottom 0.152: v25.28,3.81 24.64,3.17 23.75,3.17 23.42,3.5 11.18,3.5 8.08,6.6 8.08,13.48 v7.72,13.84 | MBED.14 33.87,39.66 33.87,37.17 33.24,36.54 32.49,36.54 31.63,35.67 31.63,25.53 v30.99,24.89
SCL  (via drill 0.35)
  Top 0.152: v37.97,29.21 35.43,29.21 34.16,30.48 MBED.10 | R18.1 43.14,25.19 IMU_1.5
  Bottom 0.152: IMU_1.5 39.12,29.21 v37.97,29.21
SDA
  Top 0.152: MBED.9 35.05,25.78 IMU_1.2 40.39,24.13 44.03,24.13 R17.1
VALVE_CURRENT  (via drill 0.35)
  Top 0.152: R29.2 50.61,28.89 v49.02,30.48
  Bottom 0.152: v49.02,30.48 46.36,30.48 45.98,30.1 C19.1 45.88,28.89 C20.1 42.23,28.89 34.18,36.94 34.18,39.79 34.16,39.8 34.16,46.86 31.75,46.86 31.75,52.2 MBED.19
VALVE_CURRENT_PRE_RC
  Top 0.152: R29.1 52.58,26.04 51.95,25.4 50.62,25.4 LM1.1 46.42,24.13 R25.2
VALVE_DIR  (via drill 0.35)
  Top 0.152: DRV8838.6 53.85,53.09 54.23,52.7 54.23,51.82 v53.72,51.31 50.7,48.29 39.63,48.29 37.12,50.8 MBED.18
VALVE_I_OUT  (via drill 0.35)
  Top 0.152: U3_VALVE.4 U3_VALVE.3 50.55,34.93 v51.06,35.43 | v49.53,54.48 50.42,53.59 DRV8838.2
  Bottom 0.152: v51.06,35.43 51.06,36.58 56.39,41.91 56.39,49.33 55.55,50.16 50.93,50.16 49.53,51.56 v49.53,54.48
VALVE_MOTOR_V1  (via drill 0.35)
  Top 0.152: DRV8838.3 48.77,53.09 v48.64,53.21
  Bottom 0.152: v48.64,53.21 45.59,56.26 45.59,59.69 44.32,60.96 39.24,60.96 38.43,61.77 U$4.8
VALVE_MOTOR_V2  (via drill 0.35)
  Top 0.152: U3_VALVE.2 U3_VALVE.1 v49.14,38.6 v49.15,38.61
  Bottom 0.152: v49.15,38.61 52.15,38.61 55.7,42.16 55.7,49.15 55.3,49.55 50.55,49.55 45.29,54.81 38.43,54.81 37.47,53.85 36.7,53.85 36.7,60.96 35.46,62.21 U$5.1
VALVE_PREGAIN  (via drill 0.35)
  Top 0.152: LM1.3 v47.25,21.59 | v46.36,25.15 48.01,26.8 48.01,30.48 47.16,31.33 | 47.16,31.33 C15.1 | 47.16,31.33 54.51,31.33 R23.2
  Bottom 0.152: v46.36,25.15 46.36,22.48 v47.25,21.59
VALVE_PWM  (via drill 0.35)
  Top 0.152: MBED.22 12.88,56.19 22.53,56.19 25.91,59.56 25.91,62.99 27.44,64.52 47.77,64.52 49.91,62.38 49.91,57.91 v50.67,57.15 | DRV8838.5 52.96,52.02 52.96,51.44 52.93,51.41 v52.33,51.41
  Bottom 0.152: v52.33,51.41 50.96,51.41 50.67,51.69 v50.67,57.15
VCC
  Top 0.152: BATT.1 39.23,3.01 | 48.47,6.48 C25.1 50.04,6.35 51.69,8 53.85,8 54.87,9.02 C29.2
  Top 0.406: 39.23,3.01 40.98,1.27 44.32,1.27 44.32,1.65 | 44.32,1.65 R9.1 | 44.32,1.65 44.32,4.95 44.45,5.08 48.13,5.08 48.35,5.29 C25.1 | DRV8801.8 48.47,6.48
  Bottom 0.152: 16.39,48.51 16.39,48.58 C3.1 | 16.39,21.13 LMZ1.1 16.39,25.21 R3.1 C1.1 | R7.1 15.12,49.78 16.39,48.51 | LMZ2.1 16.39,48.51
  Bottom 0.406: 16.39,21.13 14.73,19.48 14.73,17.78 | 14.73,17.78 12.58,17.78 11.69,18.67 11.69,30.23 14.61,33.15 14.61,43.63 LMZ2.1 | 14.73,17.78 14.73,5.08 34.16,5.08 36.2,3.05 BATT.1
VUSB  (via drill 0.35)
  Top 0.152: MBED.39 9.07,9.2 8.64,9.2 6.8,7.36 v6.8,2.54
  Bottom 0.152: USB.1 3.34,2.67 4.12,1.89 6.04,1.89 6.7,2.54 v6.8,2.54

### Text on the board
tNames: Extra IMU | Extra IMU | GND | OUT | - | +
bNames: IMU SCL | IMU SDA | GND | 3V3 | BCU+ | BCU- | Wiper | Valve+ | Valve- | DP2 | +6V | GND | DP1 | +6V | GND
tDocu: Camera Cable Slit